# EAGLE design Lia_Light (EAGLE 6.4)
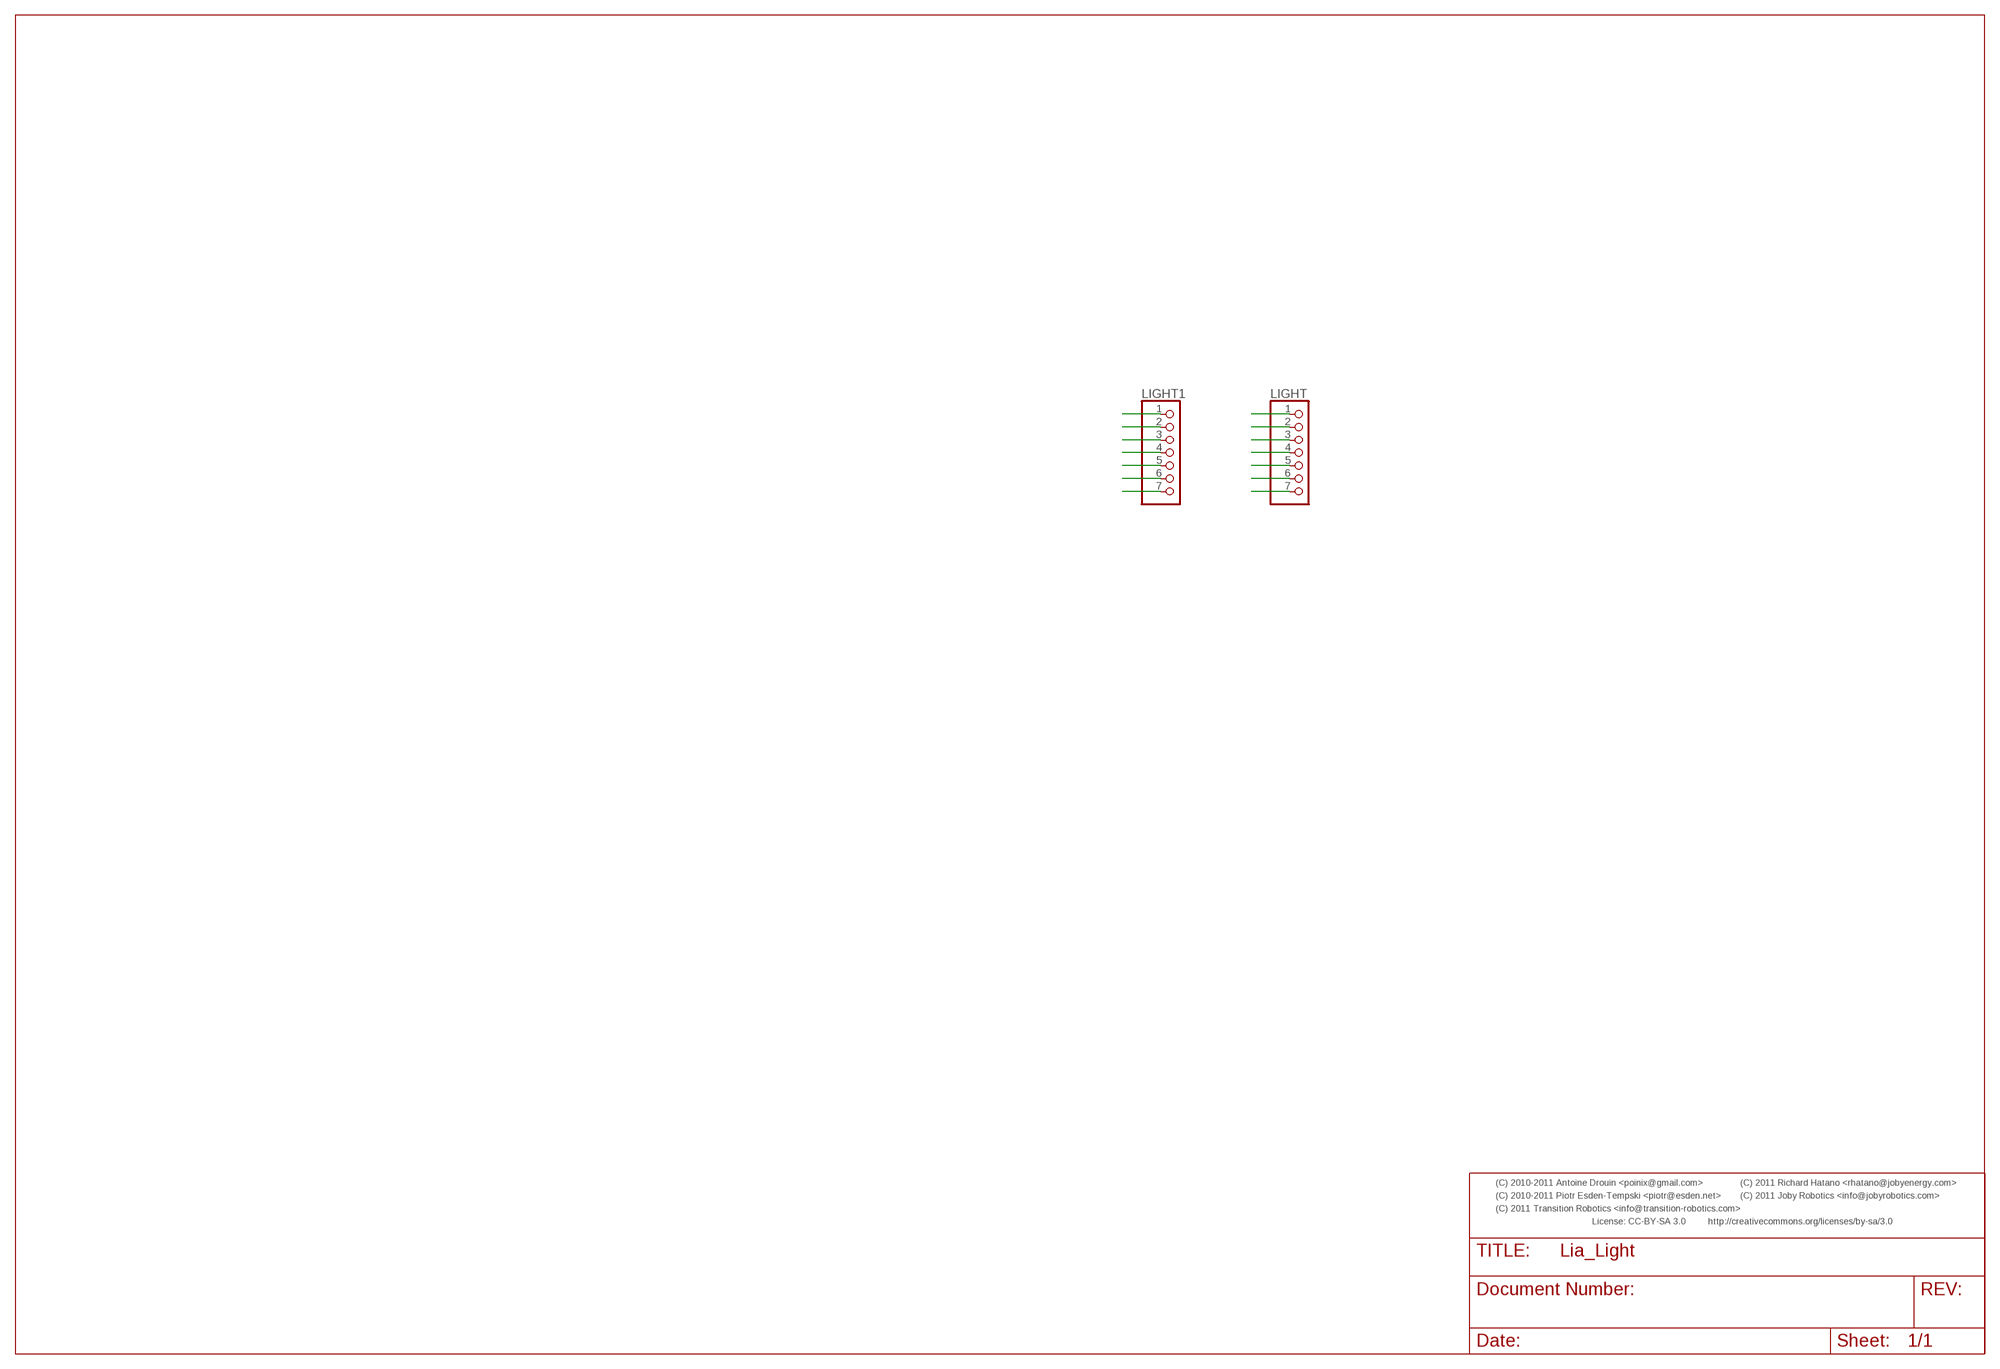
[diagram p0: schematic, sheet 1]

## Parts
LIGHT  PINHD-1X7  [1X07]
LIGHT1  PINHD-1X7  [1X07]

## Nets
GND: LIGHT1.6 LIGHT.6
INT: LIGHT1.2 LIGHT.2
LED: LIGHT1.1 LIGHT.1
SCL: LIGHT1.4 LIGHT.4
SDA: LIGHT1.3 LIGHT.3
VCC: LIGHT1.5 LIGHT.5
VIN: LIGHT1.7 LIGHT.7

## Notes on the sheet
- (C) 2010-2011 Antoine Drouin <poinix@gmail.com> | (C) 2011 Richard Hatano <rhatano@jobyenergy.com>
- (C) 2010-2011 Piotr Esden-Tempski <piotr@esden.net> | (C) 2011 Joby Robotics <info@jobyrobotics.com>
- (C) 2011 Transition Robotics <info@transition-robotics.com>
- License: CC-BY-SA 3.0 | http://creativecommons.org/licenses/by-sa/3.0

## Library data of the parts
LIGHT LIGHT1 = pinhead:PINHD-1X7: PIN HEADER

## Net classes
0 default: width 0.152 mm, drill 0.305 mm, clearance 0.152 mm

## Board
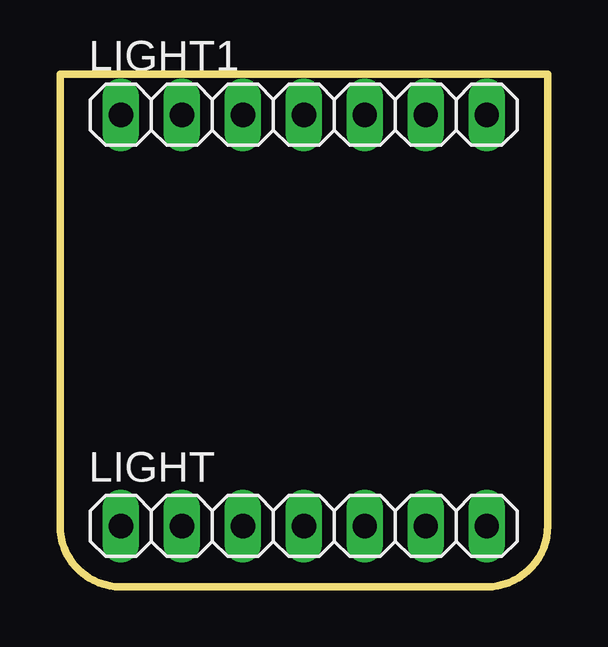
[diagram p1: board, top side]
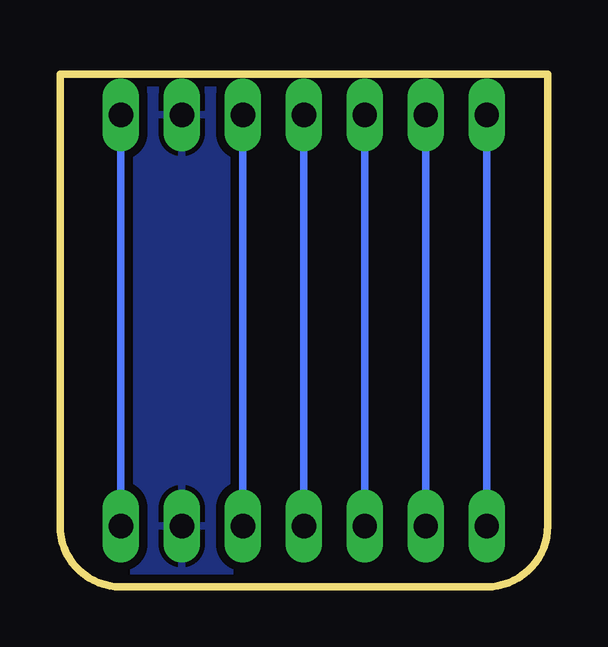
[diagram p2: board, bottom side, seen from below]

Size 20.32 x 21.39 mm. Coordinates in mm from the lower left corner, seen from the top.
Outline: 0,2.54 0,21.39 20.32,21.39 20.32,2.54 arc-90 17.78,0 2.54,0 arc-90 0,2.54
Copper layers (1*2+15*16): Top 0.035mm / dielectric 0.2mm / Route2 0.035mm / dielectric 1.5mm / Route15 0.035mm / dielectric 0.2mm / Bottom 0.035mm
Design rules "default *": minimum track width 0.15mm, minimum drill 10mil, track to track 8mil, track to pad 8mil, pad to pad 8mil, via to via 8mil, smd to smd 0.15mm, copper to edge 10mil, drill to drill 8mil, minimum pad ring 5mil, minimum via ring 5mil, stop-mask expansion 14mil, vias tented up to drill 0.31mm, thermal gap 8mil

### Footprints (pad centres in the part's own frame; a part is rotated, then mirrored left to right if it is on the bottom)
1X07 = drill 1.016 long: 1 -7.62,0; 2 -5.08,0; 3 -2.54,0; 4 0,0; 5 2.54,0; 6 5.08,0; 7 7.62,0

### Placement (x,y rotation side)
LIGHT  10.16,2.54 0 top
LIGHT1  10.16,19.68 0 top

### Tracks (layer width: path | path; a pad name or v marks a point on that pad's centre or on a via)
GND
  pour Bottom (isolate 0.356): 20.32,20.32 20.32,0 0,0 0,22.86 20.32,22.86
INT
  Bottom 0.305: LIGHT1.2 LIGHT.2
LED
  Bottom 0.305: LIGHT1.1 LIGHT.1
SCL
  Bottom 0.305: LIGHT1.4 LIGHT.4
SDA
  Bottom 0.305: LIGHT1.3 LIGHT.3
VCC
  Bottom 0.305: LIGHT1.5 LIGHT.5
VIN
  Bottom 0.305: LIGHT1.7 LIGHT.7